# EAGLE design Multiplier (EAGLE 6.4)
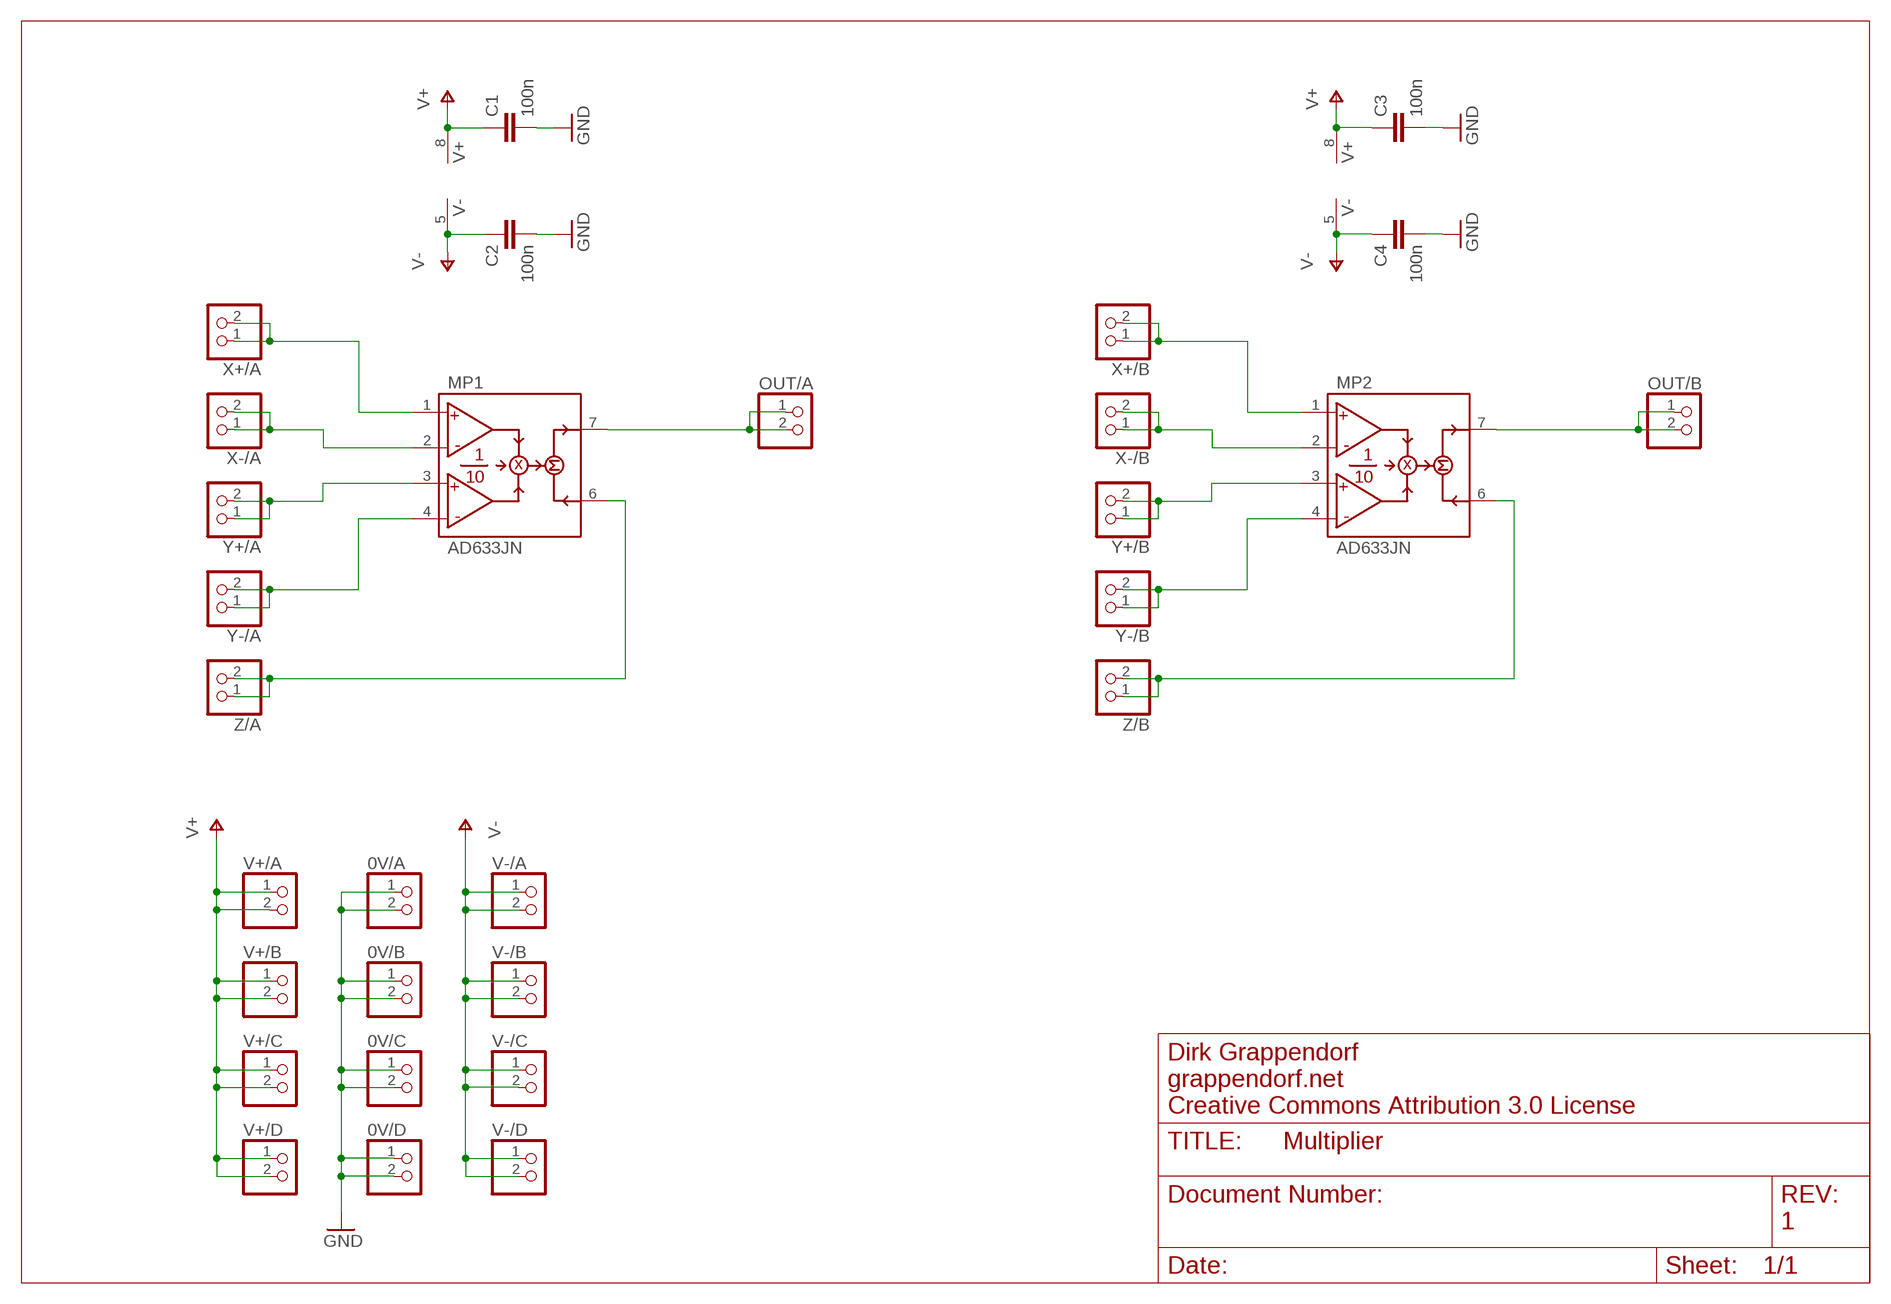
[diagram p0: schematic, sheet 1]

## Parts
0V/A  PINHD-1X2  [1X02]
0V/B  PINHD-1X2  [1X02]
0V/C  PINHD-1X2  [1X02]
0V/D  PINHD-1X2  [1X02]
C1  100n  C-EU025-025X050  [C025-025X050]
C2  100n  C-EU025-025X050  [C025-025X050]
C3  100n  C-EU025-025X050  [C025-025X050]
C4  100n  C-EU025-025X050  [C025-025X050]
MP1  AD633JN  [DIL08]
MP2  AD633JN  [DIL08]
OUT/A  PINHD-1X2  [1X02]
OUT/B  PINHD-1X2  [1X02]
V+/A  PINHD-1X2  [1X02]
V+/B  PINHD-1X2  [1X02]
V+/C  PINHD-1X2  [1X02]
V+/D  PINHD-1X2  [1X02]
V-/A  PINHD-1X2  [1X02]
V-/B  PINHD-1X2  [1X02]
V-/C  PINHD-1X2  [1X02]
V-/D  PINHD-1X2  [1X02]
X+/A  PINHD-1X2  [1X02]
X+/B  PINHD-1X2  [1X02]
X-/A  PINHD-1X2  [1X02]
X-/B  PINHD-1X2  [1X02]
Y+/A  PINHD-1X2  [1X02]
Y+/B  PINHD-1X2  [1X02]
Y-/A  PINHD-1X2  [1X02]
Y-/B  PINHD-1X2  [1X02]
Z/A  PINHD-1X2  [1X02]
Z/B  PINHD-1X2  [1X02]

## Nets
GND: 0V/A.1 0V/A.2 0V/B.1 0V/B.2 0V/C.1 0V/C.2 0V/D.1 0V/D.2 C1.2 C2.2 C3.2 C4.2
N$1: MP1.2(X2) X-/A.1 X-/A.2
N$2: MP1.1(X1) X+/A.1 X+/A.2
N$3: MP1.7(W) OUT/A.1 OUT/A.2
N$4: MP1.3(Y1) Y+/A.1 Y+/A.2
N$5: MP1.4(Y2) Y-/A.1 Y-/A.2
N$6: MP1.6(Z) Z/A.1 Z/A.2
N$7: MP2.2(X2) X-/B.1 X-/B.2
N$8: MP2.1(X1) X+/B.1 X+/B.2
N$9: MP2.3(Y1) Y+/B.1 Y+/B.2
N$10: MP2.4(Y2) Y-/B.1 Y-/B.2
N$11: MP2.6(Z) Z/B.1 Z/B.2
N$12: MP2.7(W) OUT/B.1 OUT/B.2
V+: C1.1 C3.1 MP1.8(V+) MP2.8(V+) V+/A.1 V+/A.2 V+/B.1 V+/B.2 V+/C.1 V+/C.2 V+/D.1 V+/D.2
V-: C2.1 C4.1 MP1.5(V-) MP2.5(V-) V-/A.1 V-/A.2 V-/B.1 V-/B.2 V-/C.1 V-/C.2 V-/D.1 V-/D.2

## Notes on the sheet
- Dirk Grappendorf
- grappendorf.net
- Creative Commons Attribution 3.0 License
- 1

## Library data of the parts
0V/A 0V/B 0V/C 0V/D OUT/A OUT/B V+/A V+/B V+/C V+/D V-/A V-/B V-/C V-/D X+/A X+/B X-/A X-/B Y+/A Y+/B Y-/A Y-/B Z/A Z/B = pinhead:PINHD-1X2: PIN HEADER
C1-C4 = rcl:C-EU: CAPACITOR, European symbol
MP1 MP2 = ad633-2:AD633*

## Board
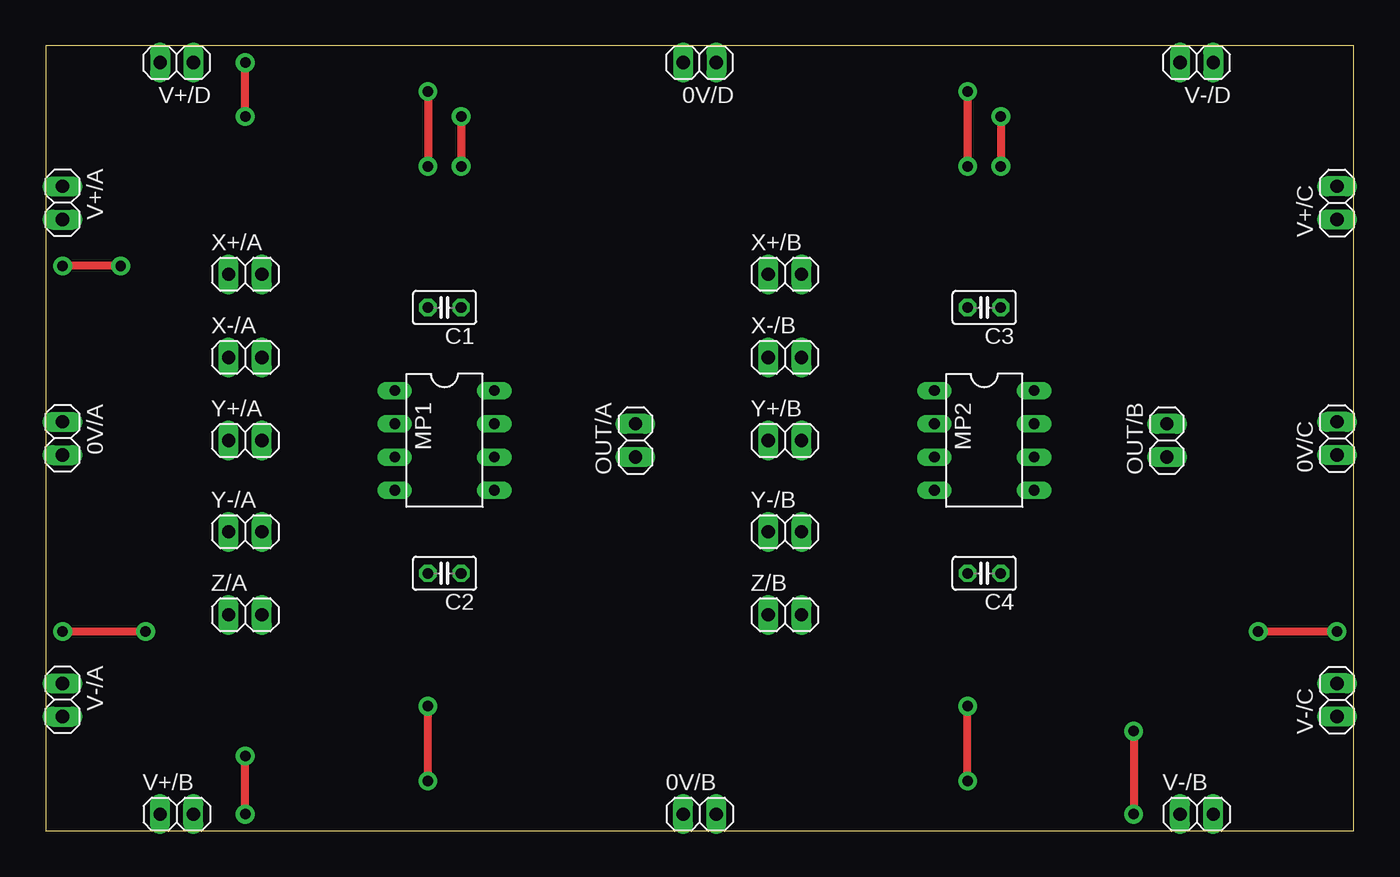
[diagram p1: board, top side]
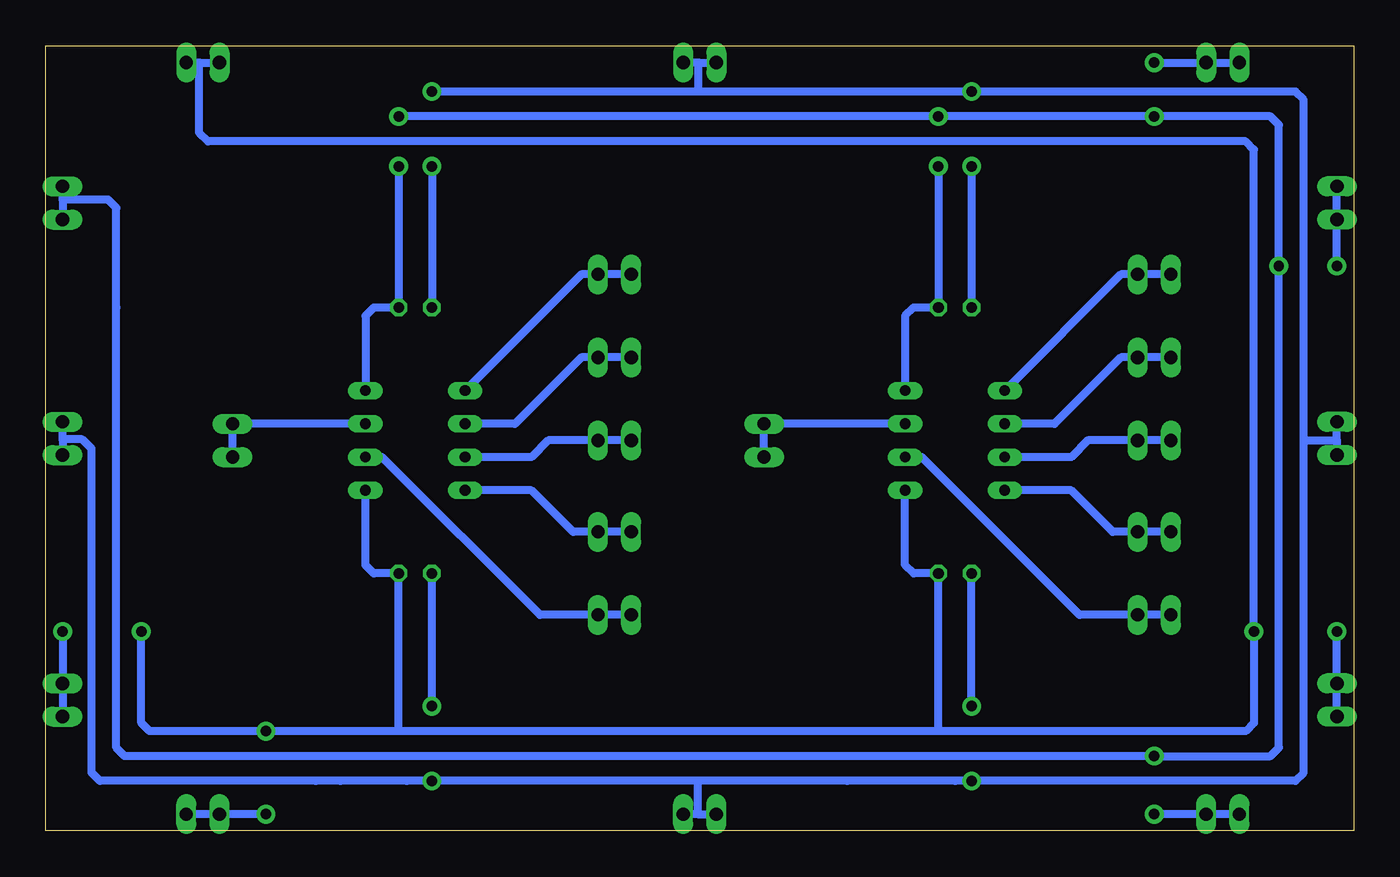
[diagram p2: board, bottom side, seen from below]

Size 100 x 60 mm. Coordinates in mm from the lower left corner, seen from the top.
Outline: 0,0 100,0 100,60 0,60 0,0
Copper layers (1*16): Top 0.035mm / dielectric 1.5mm / Bottom 0.035mm
Design rules "default *": minimum track width 10mil, minimum drill 24mil, track to track 8mil, track to pad 8mil, pad to pad 8mil, via to via 8mil, smd to smd 8mil, copper to edge 40mil, drill to drill 8mil, minimum pad ring 10mil, minimum via ring 8mil, stop-mask expansion 4mil, vias tented up to drill 0mil, thermal gap 10mil

### Footprints (pad centres in the part's own frame; a part is rotated, then mirrored left to right if it is on the bottom)
1X02 = drill 1.016 long: 1 -1.27,0; 2 1.27,0
C025-025X050 = drill 0.813 octagon: 1 -1.27,0; 2 1.27,0
DIL08 = drill 0.813 long: 1 -3.81,-3.81; 2 -1.27,-3.81; 3 1.27,-3.81; 4 3.81,-3.81; 5 3.81,3.81; 6 1.27,3.81; 7 -1.27,3.81; 8 -3.81,3.81

### Placement (x,y rotation side)
0V/A  1.27,30 270 top
0V/B  50,1.27 0 top
0V/C  98.73,30 90 top
0V/D  50,58.73 180 top
C1  30.48,40.01 180 top
C2  30.48,19.68 180 top
C3  71.75,40.01 180 top
C4  71.75,19.68 180 top
MP1  30.48,29.84 270 top
MP2  71.75,29.84 270 top
OUT/A  45.09,29.84 90 top
OUT/B  85.72,29.84 90 top
V+/A  1.27,48 270 top
V+/B  10,1.27 0 top
V+/C  98.73,48 90 top
V+/D  10,58.73 180 top
V-/A  1.27,10 270 top
V-/B  88,1.27 0 top
V-/C  98.73,10 90 top
V-/D  88,58.73 180 top
X+/A  15.24,42.55 0 top
X+/B  56.52,42.55 0 top
X-/A  15.24,36.2 0 top
X-/B  56.52,36.2 0 top
Y+/A  15.24,29.84 0 top
Y+/B  56.52,29.84 0 top
Y-/A  15.24,22.86 0 top
Y-/B  56.52,22.86 0 top
Z/A  15.24,16.51 0 top
Z/B  56.52,16.51 0 top

### Tracks (layer width: path | path; a pad name or v marks a point on that pad's centre or on a via)
GND  (via drill 0.8)
  Top 0.61: v29.21,3.81 v29.21,9.53 | v70.48,3.81 v70.48,9.53 | v29.21,56.52 v29.21,50.8 | v70.48,56.52 v70.48,50.8
  Bottom 0.61: 1.27,29.84 0V/A.2 | 1.27,29.84 0V/A.1 | 50.08,58.73 0V/D.2 | 50.08,58.73 0V/D.1 | 98.73,29.93 0V/C.1 98.48,28.48 | 98.73,29.93 0V/C.2 | 50.16,1.27 0V/B.1 | 50.16,1.27 0V/B.2 | 3.81,29.84 3.81,5.08 3.81,4.45 4.45,3.81 v29.21,3.81 | 3.81,29.84 3.81,55.88 4.45,56.52 27.94,56.52 | v29.21,3.81 30.48,3.81 | 30.48,3.81 38.73,3.81 50.16,3.81 | 50.16,3.81 v70.48,3.81 | v70.48,3.81 72.39,3.81 | 72.39,3.81 77.47,3.81 | 77.47,3.81 79.38,3.81 | 79.38,3.81 95.89,3.81 96.52,4.45 96.52,29.21 97.24,29.93 98.73,29.93 | 3.81,29.84 1.27,29.84 | 50.16,3.81 50.16,1.27 | 27.94,56.52 v29.21,56.52 | 77.47,3.81 79.38,3.81 | v29.21,9.53 C2.2 | v29.21,3.81 30.48,3.81 | v70.48,9.53 C4.2 | v70.48,3.81 72.39,3.81 | v29.21,50.8 C1.2 | 27.94,56.52 v29.21,56.52 | v29.21,56.52 50.16,56.52 | 50.16,56.52 v70.48,56.52 | v70.48,50.8 C3.2 | 50.08,58.73 50.08,56.6 50.16,56.52
N$1
  Bottom 0.61: X-/A.1 X-/A.2 17.78,36.2 22.86,31.11 MP1.2
N$2
  Bottom 0.61: X+/A.1 X+/A.2 17.78,42.55 MP1.1
N$3
  Bottom 0.61: OUT/A.1 OUT/A.2 MP1.7
N$4
  Bottom 0.61: Y+/A.1 Y+/A.2 20.32,29.84 21.59,28.57 MP1.3
N$5
  Bottom 0.61: Y-/A.1 Y-/A.2 18.41,22.86 21.59,26.04 MP1.4
N$6
  Bottom 0.61: Z/A.1 Z/A.2 20.95,16.51 33.02,28.57 MP1.6
N$7
  Bottom 0.61: X-/B.1 X-/B.2 59.05,36.2 64.14,31.11 MP2.2
N$8
  Bottom 0.61: X+/B.1 X+/B.2 59.05,42.55 MP2.1
N$9
  Bottom 0.61: Y+/B.1 Y+/B.2 61.59,29.84 62.87,28.57 MP2.3
N$10
  Bottom 0.61: Y-/B.1 Y-/B.2 59.69,22.86 62.87,26.04 MP2.4
N$11
  Bottom 0.61: Z/B.1 Z/B.2 62.23,16.51 74.3,28.57 MP2.6
N$12
  Bottom 0.61: OUT/B.1 OUT/B.2 MP2.7
V+  (via drill 0.8)
  Top 0.61: v5.71,43.18 v1.27,43.18 | v15.24,1.27 v15.24,5.71 | v15.24,54.61 v15.24,58.73 | v31.75,54.61 v31.75,50.8 | v73.03,54.61 v73.03,50.8
  Bottom 0.61: v1.27,43.18 V+/A.2 V+/A.1 | V+/D.2 V+/D.1 14.91,58.73 v15.24,58.73 | 98.73,48.26 V+/C.1 | 98.73,48.26 V+/C.2 | V+/B.1 V+/B.2 15.05,1.27 v15.24,1.27 | v5.71,43.18 5.71,6.35 6.35,5.71 v15.24,5.71 20.32,5.71 61.59,5.71 93.98,5.71 94.61,6.35 94.61,40.01 94.61,47.62 95.25,48.26 98.73,48.26 | v5.71,43.18 5.71,43.72 | v5.71,43.18 5.71,53.98 6.35,54.61 v15.24,54.61 v31.75,54.61 v73.03,54.61 | MP1.8 34.29,39.37 33.66,40.01 C1.1 v31.75,50.8 | MP2.8 75.56,39.37 74.93,40.01 C3.1 v73.03,50.8
V-  (via drill 0.8)
  Top 0.61: v1.27,15.24 v7.62,15.24 | v92.71,15.24 v98.73,15.24 | v83.19,7.62 v83.19,1.27
  Bottom 0.61: V-/A.2 V-/A.1 1.27,15.05 v1.27,15.24 | V-/C.1 V-/C.2 98.73,14.91 v98.73,15.24 | V-/B.2 V-/B.1 v83.19,1.27 | 88.27,58.73 V-/D.2 | 88.27,58.73 V-/D.1 | 31.75,7.62 8.26,7.62 7.62,8.26 v7.62,15.24 7.62,52.07 8.26,52.7 87.63,52.7 88.27,53.34 88.27,58.73 | 31.75,7.62 41.91,7.62 73.03,7.62 | 73.03,7.62 v83.19,7.62 92.08,7.62 92.71,8.26 v92.71,15.24 | MP1.5 34.29,20.32 33.66,19.68 C2.1 31.75,7.62 | MP2.5 75.56,20.32 74.93,19.68 C4.1 73.03,7.62